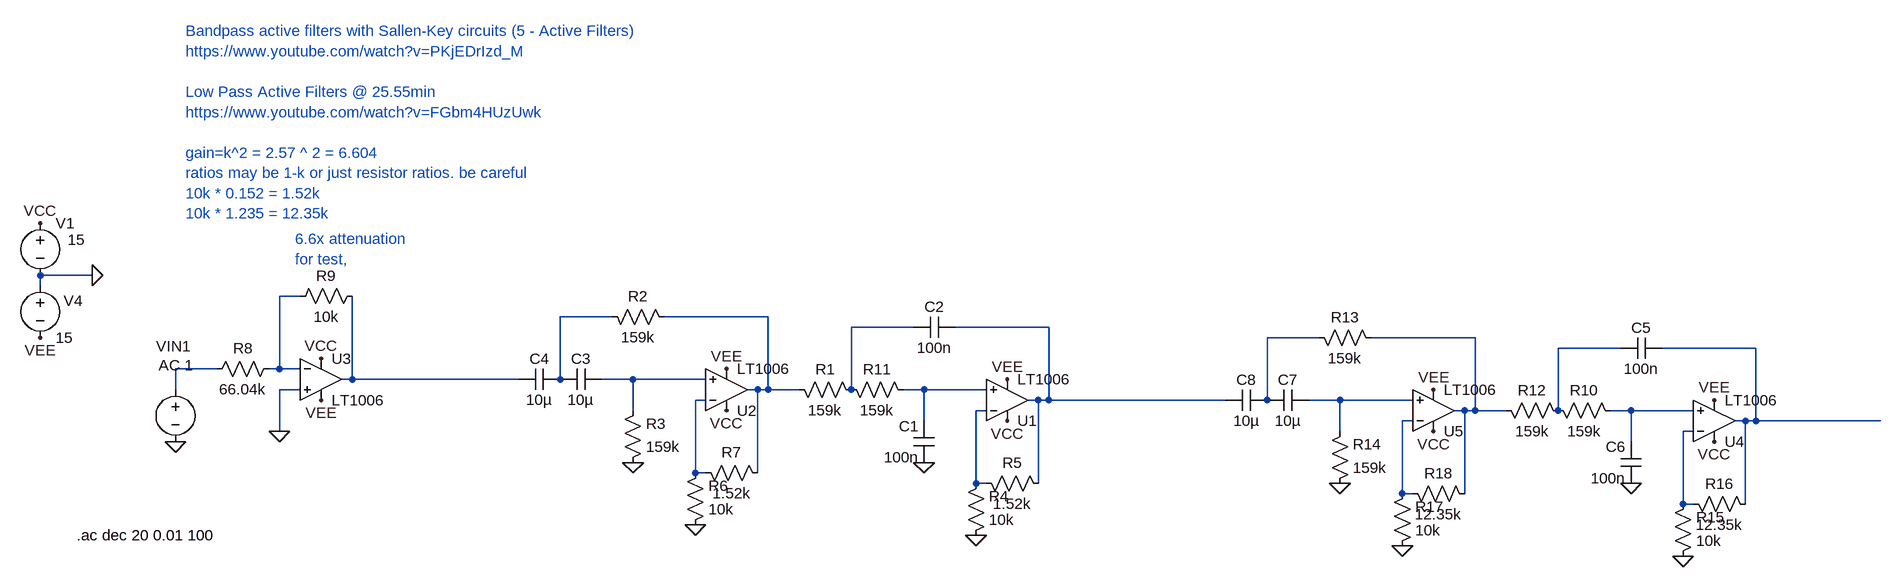
[diagram p0: schematic Draft04.asc]
Draft04.asc, the LTspice schematic file:
Version 4
SHEET 1 2756 2104
WIRE -672 -544 -752 -544
WIRE -752 -528 -752 -544
WIRE -352 -512 -384 -512
WIRE 128 -480 48 -480
WIRE 368 -480 208 -480
WIRE 592 -464 496 -464
WIRE 800 -464 656 -464
WIRE 1216 -448 1136 -448
WIRE 1456 -448 1296 -448
WIRE 1680 -432 1584 -432
WIRE 1888 -432 1744 -432
WIRE -480 -400 -544 -400
WIRE -384 -400 -384 -512
WIRE -384 -400 -400 -400
WIRE -352 -400 -384 -400
WIRE -272 -384 -272 -512
WIRE -272 -384 -288 -384
WIRE -16 -384 -272 -384
WIRE 48 -384 48 -480
WIRE 160 -384 112 -384
WIRE 272 -384 160 -384
WIRE -544 -368 -544 -400
WIRE -352 -368 -384 -368
WIRE 352 -368 336 -368
WIRE 368 -368 368 -480
WIRE 368 -368 352 -368
WIRE 416 -368 368 -368
WIRE 496 -368 496 -464
WIRE 608 -368 576 -368
WIRE 704 -368 608 -368
WIRE 272 -352 256 -352
WIRE 784 -352 768 -352
WIRE 800 -352 800 -464
WIRE 800 -352 784 -352
WIRE 1072 -352 800 -352
WIRE 1136 -352 1136 -448
WIRE 1248 -352 1200 -352
WIRE 1360 -352 1248 -352
WIRE 160 -336 160 -384
WIRE 704 -336 688 -336
WIRE 1440 -336 1424 -336
WIRE 1456 -336 1456 -448
WIRE 1456 -336 1440 -336
WIRE 1504 -336 1456 -336
WIRE 1584 -336 1584 -432
WIRE 1696 -336 1664 -336
WIRE 1792 -336 1696 -336
WIRE 608 -320 608 -368
WIRE 1360 -320 1344 -320
WIRE 1872 -320 1856 -320
WIRE 1888 -320 1888 -432
WIRE 1888 -320 1872 -320
WIRE 2080 -320 1888 -320
WIRE -384 -304 -384 -368
WIRE 1248 -304 1248 -352
WIRE 1792 -304 1776 -304
WIRE 1696 -288 1696 -336
WIRE 256 -240 256 -352
WIRE 272 -240 256 -240
WIRE 352 -240 352 -368
WIRE 688 -224 688 -336
WIRE 704 -224 688 -224
WIRE 784 -224 784 -352
WIRE 1344 -208 1344 -320
WIRE 1360 -208 1344 -208
WIRE 1440 -208 1440 -336
WIRE 1776 -192 1776 -304
WIRE 1792 -192 1776 -192
WIRE 1872 -192 1872 -320
FLAG -752 -624 VCC
FLAG -752 -448 VEE
FLAG 736 -320 VCC
FLAG 736 -384 VEE
FLAG -672 -544 0
FLAG 608 -256 0
FLAG -544 -288 0
FLAG 304 -336 VCC
FLAG 304 -400 VEE
FLAG 160 -256 0
FLAG 688 -144 0
FLAG 256 -160 0
FLAG -320 -416 VCC
FLAG -320 -352 VEE
FLAG -384 -304 0
FLAG 1824 -288 VCC
FLAG 1824 -352 VEE
FLAG 1696 -224 0
FLAG 1392 -304 VCC
FLAG 1392 -368 VEE
FLAG 1248 -224 0
FLAG 1776 -112 0
FLAG 1344 -128 0
SYMBOL voltage -752 -640 R0
WINDOW 123 0 0 Left 0
WINDOW 39 0 0 Left 0
WINDOW 3 42 41 Left 2
SYMATTR Value 15
SYMATTR InstName V1
SYMBOL voltage -752 -544 R0
WINDOW 123 0 0 Left 0
WINDOW 39 0 0 Left 0
WINDOW 0 36 39 Left 2
SYMATTR InstName V4
SYMATTR Value 15
SYMBOL res 480 -384 M90
WINDOW 0 0 56 VBottom 2
WINDOW 3 32 56 VTop 2
SYMATTR InstName R11
SYMATTR Value 159k
SYMBOL OpAmps\\LT1006 736 -288 M180
SYMATTR InstName U1
SYMBOL res 400 -384 M90
WINDOW 0 0 56 VBottom 2
WINDOW 3 32 56 VTop 2
SYMATTR InstName R1
SYMATTR Value 159k
SYMBOL cap 656 -448 M270
WINDOW 0 32 32 VTop 2
WINDOW 3 0 32 VBottom 2
SYMATTR InstName C2
SYMATTR Value 100n
SYMBOL cap 624 -320 M0
SYMATTR InstName C1
SYMATTR Value 100n
SYMBOL voltage -544 -384 R0
WINDOW 123 -26 -22 Left 2
WINDOW 39 0 0 Left 0
WINDOW 3 -341 151 Left 2
WINDOW 0 -30 -51 Left 2
SYMATTR Value2 AC 1
SYMATTR Value ""
SYMATTR InstName VIN1
SYMBOL res 112 -496 M90
WINDOW 0 0 56 VBottom 2
WINDOW 3 32 56 VTop 2
SYMATTR InstName R2
SYMATTR Value 159k
SYMBOL OpAmps\\LT1006 304 -304 M180
SYMATTR InstName U2
SYMBOL res 144 -240 M180
WINDOW 0 36 76 Left 2
WINDOW 3 36 40 Left 2
SYMATTR InstName R3
SYMATTR Value 159k
SYMBOL cap 48 -400 M90
WINDOW 0 0 32 VBottom 2
WINDOW 3 32 32 VTop 2
SYMATTR InstName C3
SYMATTR Value 10µ
SYMBOL cap -16 -400 M90
WINDOW 0 0 32 VBottom 2
WINDOW 3 32 32 VTop 2
SYMATTR InstName C4
SYMATTR Value 10µ
SYMBOL res 672 -128 M180
WINDOW 0 36 76 Left 2
WINDOW 3 36 40 Left 2
SYMATTR InstName R4
SYMATTR Value 10k
SYMBOL res 800 -208 M270
WINDOW 0 32 56 VTop 2
WINDOW 3 0 56 VBottom 2
SYMATTR InstName R5
SYMATTR Value 1.52k
SYMBOL res 240 -144 M180
WINDOW 0 36 76 Left 2
WINDOW 3 36 40 Left 2
SYMATTR InstName R6
SYMATTR Value 10k
SYMBOL res 368 -224 M270
WINDOW 0 32 56 VTop 2
WINDOW 3 0 56 VBottom 2
SYMATTR InstName R7
SYMATTR Value 1.52k
SYMBOL OpAmps\\LT1006 -320 -448 R0
SYMATTR InstName U3
SYMBOL res -496 -384 R270
WINDOW 0 32 56 VTop 2
WINDOW 3 0 56 VBottom 2
SYMATTR InstName R8
SYMATTR Value 66.04k
SYMBOL res -368 -496 R270
WINDOW 0 32 56 VTop 2
WINDOW 3 0 56 VBottom 2
SYMATTR InstName R9
SYMATTR Value 10k
SYMBOL res 1568 -352 M90
WINDOW 0 0 56 VBottom 2
WINDOW 3 32 56 VTop 2
SYMATTR InstName R10
SYMATTR Value 159k
SYMBOL OpAmps\\LT1006 1824 -256 M180
SYMATTR InstName U4
SYMBOL res 1488 -352 M90
WINDOW 0 0 56 VBottom 2
WINDOW 3 32 56 VTop 2
SYMATTR InstName R12
SYMATTR Value 159k
SYMBOL cap 1744 -416 M270
WINDOW 0 32 32 VTop 2
WINDOW 3 0 32 VBottom 2
SYMATTR InstName C5
SYMATTR Value 100n
SYMBOL cap 1712 -288 M0
SYMATTR InstName C6
SYMATTR Value 100n
SYMBOL res 1200 -464 M90
WINDOW 0 0 56 VBottom 2
WINDOW 3 32 56 VTop 2
SYMATTR InstName R13
SYMATTR Value 159k
SYMBOL OpAmps\\LT1006 1392 -272 M180
SYMATTR InstName U5
SYMBOL res 1232 -208 M180
WINDOW 0 36 76 Left 2
WINDOW 3 36 40 Left 2
SYMATTR InstName R14
SYMATTR Value 159k
SYMBOL cap 1136 -368 M90
WINDOW 0 0 32 VBottom 2
WINDOW 3 32 32 VTop 2
SYMATTR InstName C7
SYMATTR Value 10µ
SYMBOL cap 1072 -368 M90
WINDOW 0 0 32 VBottom 2
WINDOW 3 32 32 VTop 2
SYMATTR InstName C8
SYMATTR Value 10µ
SYMBOL res 1760 -96 M180
WINDOW 0 36 76 Left 2
WINDOW 3 36 40 Left 2
SYMATTR InstName R15
SYMATTR Value 10k
SYMBOL res 1888 -176 M270
WINDOW 0 32 56 VTop 2
WINDOW 3 0 56 VBottom 2
SYMATTR InstName R16
SYMATTR Value 12.35k
SYMBOL res 1328 -112 M180
WINDOW 0 36 76 Left 2
WINDOW 3 36 40 Left 2
SYMATTR InstName R17
SYMATTR Value 10k
SYMBOL res 1456 -192 M270
WINDOW 0 32 56 VTop 2
WINDOW 3 0 56 VBottom 2
SYMATTR InstName R18
SYMATTR Value 12.35k
TEXT -696 -144 Left 2 !.ac dec 20 0.01 100
TEXT -528 -920 Left 2 ;Bandpass active filters with Sallen-Key circuits (5 - Active Filters)\nhttps://www.youtube.com/watch?v=PKjEDrIzd_M \n \nLow Pass Active Filters @ 25.55min\nhttps://www.youtube.com/watch?v=FGbm4HUzUwk\n \ngain=k^2 = 2.57 ^ 2 = 6.604 \nratios may be 1-k or just resistor ratios. be careful\n10k * 0.152 = 1.52k\n10k * 1.235 = 12.35k
TEXT -360 -600 Left 2 ;6.6x attenuation\nfor test,

The netlist it stands for:
* Draft04.asc
V1 VCC 0 15
V4 0 VEE 15
R11 N004 N013 159k
XU1 N013 N016 VCC VEE N005 LT1006  ; pins In+ In- V+ V- OUT
R1 N003 N004 159k
C2 N005 N004 100n
C1 N013 0 100n
VIN1 N010 0 AC 1
R2 N002 N003 159k
XU2 N012 N014 VCC VEE N003 LT1006  ; pins In+ In- V+ V- OUT
R3 0 N012 159k
C3 N002 N012 10µ
C4 N011 N002 10µ
R4 0 N016 10k
R5 N005 N016 1.52k
R6 0 N014 10k
R7 N003 N014 1.52k
XU3 0 N001 VCC VEE N011 LT1006  ; pins In+ In- V+ V- OUT
R8 N010 N001 66.04k
R9 N001 N011 10k
R10 N008 N017 159k
XU4 N017 N019 VCC VEE N009 LT1006  ; pins In+ In- V+ V- OUT
R12 N007 N008 159k
C5 N009 N008 100n
C6 N017 0 100n
R13 N006 N007 159k
XU5 N015 N018 VCC VEE N007 LT1006  ; pins In+ In- V+ V- OUT
R14 0 N015 159k
C7 N006 N015 10µ
C8 N005 N006 10µ
R15 0 N019 10k
R16 N009 N019 12.35k
R17 0 N018 10k
R18 N007 N018 12.35k
.ac dec 20 0.01 100
* Bandpass active filters with Sallen-Key circuits (5 - Active Filters)
* https://www.youtube.com/watch?v=PKjEDrIzd_M
* Low Pass Active Filters @ 25.55min
* https://www.youtube.com/watch?v=FGbm4HUzUwk
* gain=k^2 = 2.57 ^ 2 = 6.604
* ratios may be 1-k or just resistor ratios. be careful
* 10k * 0.152 = 1.52k
* 10k * 1.235 = 12.35k
* 6.6x attenuation
* for test,
.lib LTC.lib
.backanno
.end